# Altium schematic sheet EPS_MPPT_X_Boost-Converter.SchDoc: MPPT-X / Boost-Converter
size A3; SheetNumber: 9; SheetTotal: 51
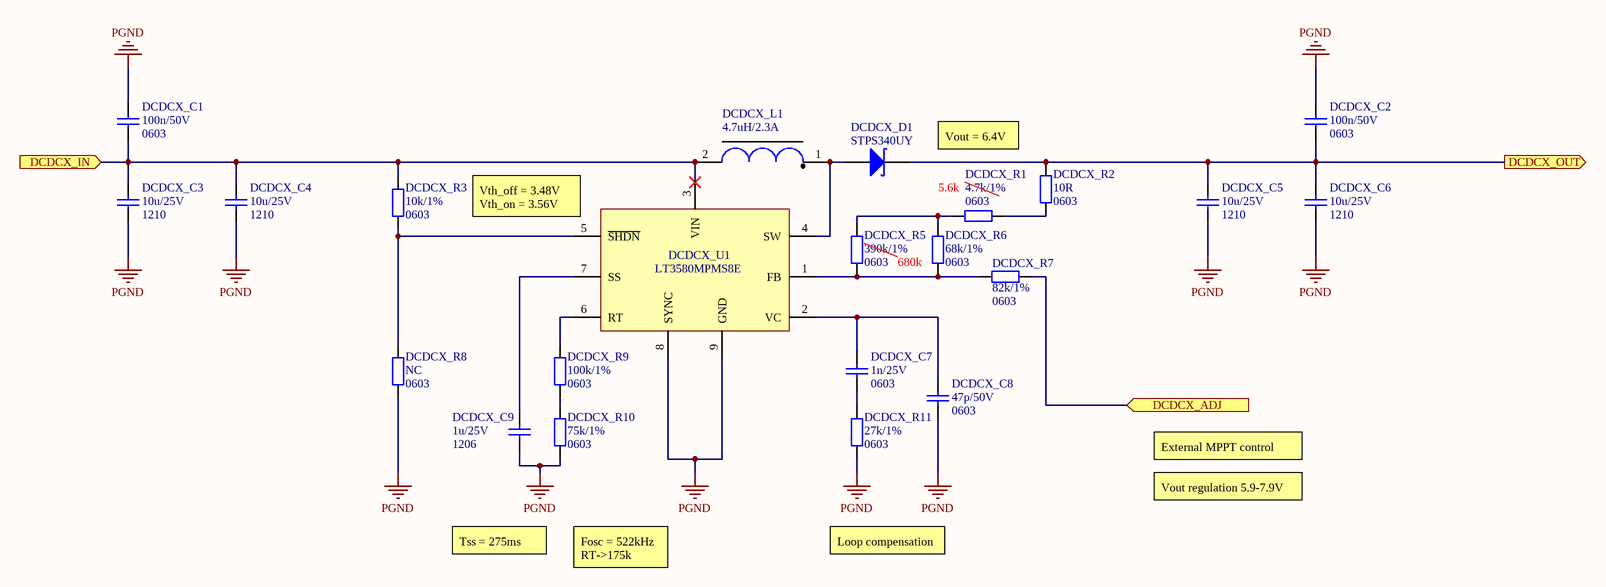
[diagram p0: EPS_MPPT_X_Boost-Converter.SchDoc]

## Parts
DCDCX_C1  Package: 0603  [SMD_Capacitor_0603]  (hidden comment: 100n/50V)
DCDCX_C2  Package: 0603  [SMD_Capacitor_0603]  (hidden comment: 100n/50V)
DCDCX_C3  Package: 1210  [SMD_Capacitor_1210]  (hidden comment: 10u/25V)
DCDCX_C4  Package: 1210  [SMD_Capacitor_1210]  (hidden comment: 10u/25V)
DCDCX_C5  Package: 1210  [SMD_Capacitor_1210]  (hidden comment: 10u/25V)
DCDCX_C6  Package: 1210  [SMD_Capacitor_1210]  (hidden comment: 10u/25V)
DCDCX_C7  value 1n/25V  Package: 0603  [SMD_Capacitor_0603]  (hidden comment: Cap)
DCDCX_C8  value 47p/50V  Package: 0603  [SMD_Capacitor_0603]  (hidden comment: Cap)
DCDCX_C9  Package: 1206  [SMD_Capacitor_1206]  (hidden comment: 1u/25V)
DCDCX_D1  STPS340UY  [DO-214AA]
DCDCX_L1  4.7uH/2.3A  [Coilcraft_MSS6132]
DCDCX_R1  Package: 0603  [SMD_Resistor_0603]  (hidden comment: 4.7k/1%)
DCDCX_R2  Package: 0603  [SMD_Resistor_0603]  (hidden comment: 10R)
DCDCX_R3  Package: 0603  [SMD_Resistor_0603]  (hidden comment: 10k/1%)
DCDCX_R5  Package: 0603  [SMD_Resistor_0603]  (hidden comment: 390k/1%)
DCDCX_R6  Package: 0603  [SMD_Resistor_0603]  (hidden comment: 68k/1%)
DCDCX_R7  Package: 0603  [SMD_Resistor_0603]  (hidden comment: 82k/1%)
DCDCX_R8  Package: 0603  [SMD_Resistor_0603]  (hidden comment: NC)
DCDCX_R9  Package: 0603  [SMD_Resistor_0603]  (hidden comment: 100k/1%)
DCDCX_R10  Package: 0603  [SMD_Resistor_0603]  (hidden comment: 75k/1%)
DCDCX_R11  Package: 0603  [SMD_Resistor_0603]  (hidden comment: 27k/1%)
DCDCX_U1  (no value)  [LT-MS8E-8-1880X1680TP_N]

## Ports
DCDCX_ADJ (in), DCDCX_IN (in), DCDCX_OUT (out)

## Nets
PGND: DCDCX_C1.1 DCDCX_C2.1 DCDCX_C3.2 DCDCX_C4.2 DCDCX_C5.2 DCDCX_C6.2 DCDCX_C8.2 DCDCX_C9.2 DCDCX_R8.2 DCDCX_R10.2 DCDCX_R11.2 DCDCX_U1.8(SYNC) DCDCX_U1.9(GND)
DCDCX_ADJ: DCDCX_R7.2 ; port DCDCX_ADJ
DCDCX_IN: DCDCX_C1.2 DCDCX_C3.1 DCDCX_C4.1 DCDCX_L1.2 DCDCX_R3.1 DCDCX_U1.3(VIN) ; port DCDCX_IN
DCDCX_OUT: DCDCX_C2.2 DCDCX_C5.1 DCDCX_C6.1 DCDCX_D1.K DCDCX_R2.2 ; port DCDCX_OUT
NetDCDCX_C7_1: DCDCX_C7.1 DCDCX_C8.1 DCDCX_U1.2(VC)
NetDCDCX_C7_2: DCDCX_C7.2 DCDCX_R11.1
NetDCDCX_C9_1: DCDCX_C9.1 DCDCX_U1.7(SS)
NetDCDCX_D1_A: DCDCX_D1.A DCDCX_L1.1 DCDCX_U1.4(SW)
NetDCDCX_R1_1: DCDCX_R1.1 DCDCX_R5.1 DCDCX_R6.1
NetDCDCX_R1_2: DCDCX_R1.2 DCDCX_R2.1
NetDCDCX_R3_2: DCDCX_R3.2 DCDCX_R8.1 DCDCX_U1.5(~{SHDN})
NetDCDCX_R5_2: DCDCX_R5.2 DCDCX_R6.2 DCDCX_R7.1 DCDCX_U1.1(FB)
NetDCDCX_R9_1: DCDCX_R9.1 DCDCX_U1.6(RT)
NetDCDCX_R9_2: DCDCX_R9.2 DCDCX_R10.1

## Notes on the sheet
- Vout = 6.4V
- (near DCDCX_U1) Vth_off = 3.48V
  Vth_on = 3.56V
- (near DCDCX_R1) 5.6k
- (near DCDCX_R6) 680k
- External MPPT control
- Vout regulation 5.9-7.9V
- Tss = 275ms
- Fosc = 522kHz
  RT->175k
- Loop compensation
- Title:
- Project:
- Author:
- Model:
- Document Number:
- Checked by:
- Rev:
- Date:
- Approved by:
- Sheet:
- of
- File name:

## Library data of the parts
DCDCX_C1 DCDCX_C2 = Cer_C0603T104K5RALTU: Ceramic Cap Kemet COTS 100n/50V X7R 0603; Manufacturer: Kemet; ManufacturerPartNumber: C0603T104K5RALTU; Value: 100n/50V
DCDCX_C3-DCDCX_C6 = Cer_GCJ32ER71E106KA12L: Ceramic Cap Murata Automotive 10u/25V X7R 1210; Manufacturer: Murata; ManufacturerPartNumber: GCJ32ER71E106KA12L; Value: 10u/25V
DCDCX_C9 = Cer_C1206T105K3RALTU: Ceramic Cap Kemet COTS 1u/25V X7R 1206; ManufacturerPartNumber: C1206T105K3RALTU; Manufacturer: Kemet; Value: 1u/25V
DCDCX_D1 = STPS340x: 3A/40V Power Schottky Rectifier.; Manufacturer: STMicroelectronics; Value: STPS340UY
DCDCX_L1 = MSS6132-472MLx: Coilcraft MSS6132 Inductor, L=4.7uH, Irise20deg=2.3A, ESR=43mR, SRF=65MHz.; Manufacturer: Coilcraft; ManufacturerPartNumber: MSS6132-472MLx; Value: 4.7uH/2.3A
DCDCX_R1-DCDCX_R3 DCDCX_R5-DCDCX_R11 = Res
  DCDCX_R1: Value: 4.7k/1%
  DCDCX_R2: Value: 10R
  DCDCX_R3: Value: 10k/1%
  DCDCX_R5: Value: 390k/1%
  DCDCX_R6: Value: 68k/1%
  DCDCX_R7: Value: 82k/1%
  DCDCX_R8: Value: NC
  DCDCX_R9: Value: 100k/1%
  DCDCX_R10: Value: 75k/1%
  DCDCX_R11: Value: 27k/1%
DCDCX_U1 = LT3580MPMS8E: Boost Conv 2A, Soft-Start, Synchro; Manufacturer: Linear Technology; ManufacturerPartNumber: LT3580MPMS8E; HelpUrl: http://cds.linear.com/docs/en/datasheet/3580fg.pdf